# EAGLE schematic UniRF-Rev01 (EAGLE 7.3.0)
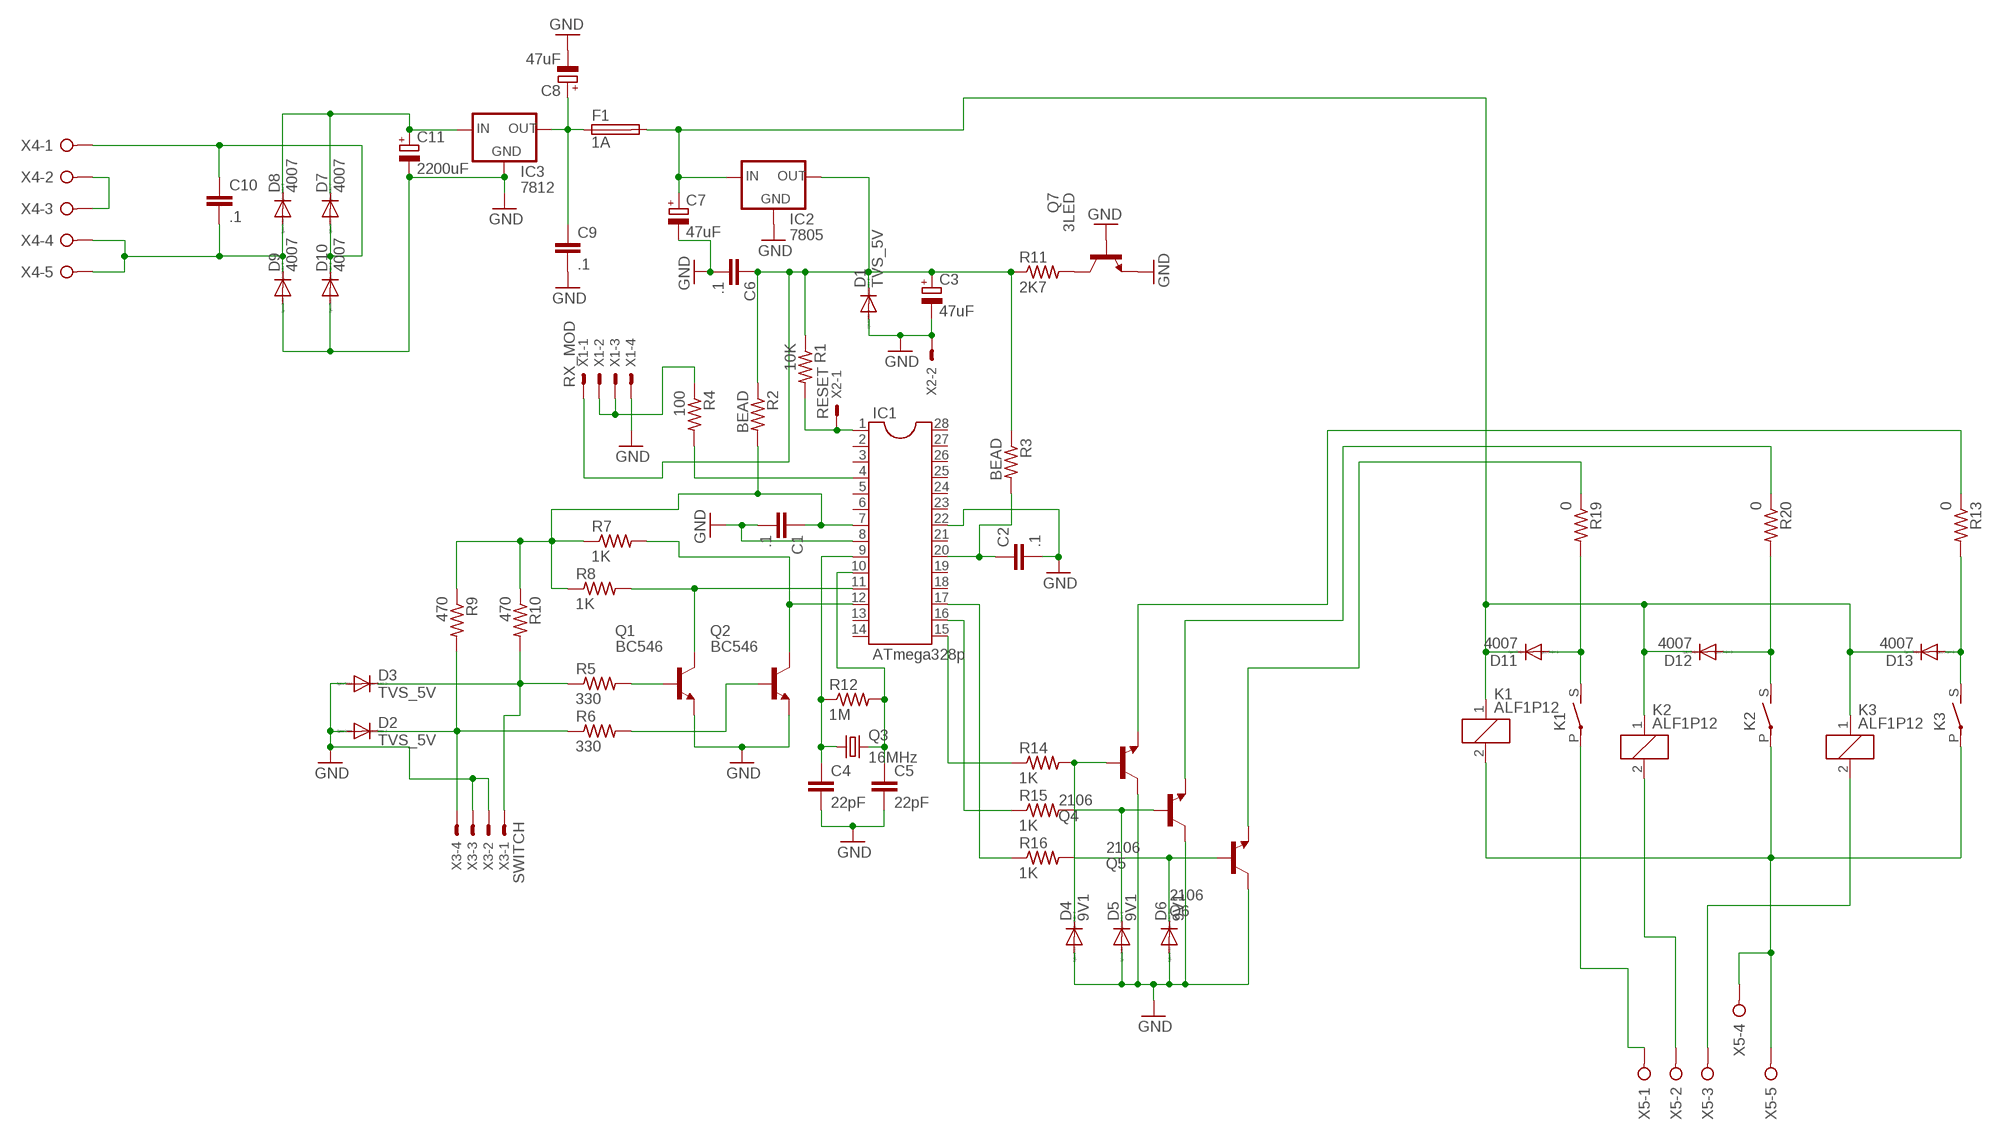
[diagram p0: schematic, sheet 1]

## Parts
C1  .1  C-EUC1210K  [C1210K]
C2  .1  C-EUC1210K  [C1210K]
C3  47uF  CPOL-EUE5-8.5  [E5-8,5]
C4  22pF  C-EUC1210K  [C1210K]
C5  22pF  C-EUC1210K  [C1210K]
C6  .1  C-EUC1210K  [C1210K]
C7  47uF  CPOL-EUE5-8.5  [E5-8,5]
C8  47uF  CPOL-EUE5-8.5  [E5-8,5]
C9  .1  C-EUC1210K  [C1210K]
C10  .1  C-EU075-042X103  [C075-042X103]
C11  2200uF  CPOL-EUE7.5-18  [E7,5-18]
D1  TVS_5V  1N4148DO35-10  [DO35-10]
D2  TVS_5V  1N4148DO35-10  [DO35-10]
D3  TVS_5V  1N4148DO35-10  [DO35-10]
D4  9V1  1N4148DO35-7  [DO35-7]
D5  9V1  1N4148DO35-7  [DO35-7]
D6  9V1  1N4148DO35-7  [DO35-7]
D7  4007  1N5059  [DO204-10]
D8  4007  1N5059  [DO204-10]
D9  4007  1N5059  [DO204-10]
D10  4007  1N5059  [DO204-10]
D11  4007  1N4148DO35-10  [DO35-10]
D12  4007  1N4148DO35-10  [DO35-10]
D13  4007  1N4148DO35-10  [DO35-10]
F1  1A  19560  [19560]
IC1  ATmega328p  DIL28-3  [DIL28-3]
IC2  7805  78XXS  [78XXS]
IC3  7812  78XXS  [78XXS]
K1  ALF1P12  G2RA  [G2RA]
K2  ALF1P12  G2RA  [G2RA]
K3  ALF1P12  G2RA  [G2RA]
Q1  BC546  BC546A  [TO92-EBC]
Q2  BC546  BC546A  [TO92-EBC]
Q3  16MHz  CRYSTALHC49S  [HC49/S]
Q4  2106  BC546A  [TO92-EBC]
Q5  2106  BC546A  [TO92-EBC]
Q6  2106  BC546A  [TO92-EBC]
Q7  3LED  BC546A  [TO92-EBC]
R1  10K  R-US_0309/10  [0309/10]
R2  BEAD  R-US_0309/10  [0309/10]
R3  BEAD  R-US_0309/12  [0309/12]
R4  100  R-US_0309/10  [0309/10]
R5  330  R-US_0309/10  [0309/10]
R6  330  R-US_0309/10  [0309/10]
R7  1K  R-US_0309/10  [0309/10]
R8  1K  R-US_0309/10  [0309/10]
R9  470  R-US_0309/10  [0309/10]
R10  470  R-US_0309/10  [0309/10]
R11  2K7  R-US_0309/10  [0309/10]
R12  1M  R-US_0309/V  [0309V]
R13  0  R-US_0207/12  [0207/12]
R14  1K  R-US_R1210  [R1210]
R15  1K  R-US_R1210  [R1210]
R16  1K  R-US_R1210  [R1210]
R19  0  R-US_0207/12  [0207/12]
R20  0  R-US_0207/12  [0207/12]
X1  RX_MOD  22-23-2041  [22-23-2041]
X2  RESET  22-23-2021  [22-23-2021]
X3  SWITCH  22-23-2041  [22-23-2041]
X4  W237-05P  [W237-5P]
X5  W237-05P  [W237-5P]

## Nets
GND: C1.2 C2.2 C3.- C4.2 C5.2 C6.2 C7.- C8.- C9.2 C11.- D1.A D2.A D3.A D4.A D5.A D6.A D9.A D10.A IC1.8 IC1.22 IC2.GND IC3.GND Q1.E Q2.E Q4.C Q5.C Q6.C Q7.B Q7.E X1.4 X2.2 X3.2 X3.3
N$1: D4.C Q4.B R14.2
N$2: IC1.1 R1.2 X2.1
N$3: IC1.4 R4.2
N$4: C2.1 IC1.20 R3.2
N$5: R4.1 X1.2 X1.3
N$7: IC1.11 Q1.C R8.2
N$8: Q1.B R5.2
N$9: C3.+ C6.1 D1.C IC2.OUT R1.1 R2.1 R3.1 R11.1 X1.1
N$10: Q2.B R6.2
N$11: IC1.12 Q2.C R7.2
N$12: C1.1 IC1.7 R2.2 R7.1 R8.1 R9.1 R10.1
N$13: C4.1 IC1.9 Q3.1 R12.1
N$14: C5.1 IC1.10 Q3.2 R12.2
N$15: D3.C R5.1 R10.2 X3.1
N$16: D2.C R6.1 R9.2 X3.4
N$17: D6.C Q6.B R16.2
N$18: IC1.15 R14.1
N$19: IC1.16 R15.1
N$20: IC1.17 R16.1
N$21: D5.C Q5.B R15.2
N$22: Q7.C R11.2
N$24: C7.+ D11.C D12.C D13.C F1.2 IC2.IN K1.1 K2.1 K3.1
N$25: C8.+ C9.1 F1.1 IC3.OUT
N$26: C10.2 D8.A D9.C X4.4 X4.5
N$27: Q4.E R13.1
N$28: Q5.E R20.1
N$29: Q6.E R19.1
N$30: C10.1 D7.A D10.C X4.1
N$31: C11.+ D7.C D8.C IC3.IN
N$32: D13.A K3.S(2:S) R13.2
N$33: D11.A K1.S(2:S) R19.2
N$36: K2.2 X5.2
N$37: X4.2 X4.3
N$38: D12.A K2.S(2:S) R20.2
N$39: K1.P(2:P) X5.1
N$42: K3.2 X5.3
N$43: K1.2 K2.P(2:P) K3.P(2:P) X5.4 X5.5
Unconnected: IC1.2 IC1.3 IC1.5 IC1.6 IC1.13 IC1.14 IC1.18 IC1.19 IC1.21 IC1.23 IC1.24 IC1.25 IC1.26 IC1.27 IC1.28

## Library data of the parts
C1 C2 C4-C6 C9 C10 = resistor:C-EU: CAPACITOR, European symbol
C3 C7 C8 C11 = resistor:CPOL-EU: POLARIZED CAPACITOR, European symbol
D1-D6 D11-D13 = diode:1N4148: DIODE high speed (Philips)
D7-D10 = diode:1N5059: DIODE controlled avalanche rectifier
F1 = fuse:19560: FUSE HOLDER TR5, Wickmann; MPN: 56000001009; OC_FARNELL: 1185363; OC_NEWARK: 15P8392
IC1 = ic-package:DIL28: Dual In Line
IC2 IC3 = v-reg:78XXS: VOLTAGE REGULATOR
K1-K3 = relay:G2RA: RELAY 1 x norm. open, Omron; OC_FARNELL: unknown; OC_NEWARK: unknown
Q1 Q2 Q4-Q7 = transistor-npn:BC546*: NPN Transistor
Q3 = crystal:CRYSTAL: CRYSTAL; OC_FARNELL: 1667008; OC_NEWARK: unknown
R1-R16 R19 R20 = resistor:R-US_: RESISTOR, American symbol
X1 X3 = con-molex:22-23-2041: .100" (2.54mm) Center Header - 4 Pin; MF: MOLEX; MPN: 22-23-2041; OC_FARNELL: 1462920; OC_NEWARK: 38C0355
X2 = con-molex:22-23-2021: .100" (2.54mm) Center Header - 2 Pin; MF: MOLEX; MPN: 22-23-2021; OC_FARNELL: 1462926; OC_NEWARK: 25C3832
X4 X5 = con-wago-508:W237-05P: WAGO SREW CLAMP; OC_FARNELL: unknown; OC_NEWARK: unknown